# Altium schematic sheet 原理图.SchDoc
size A4
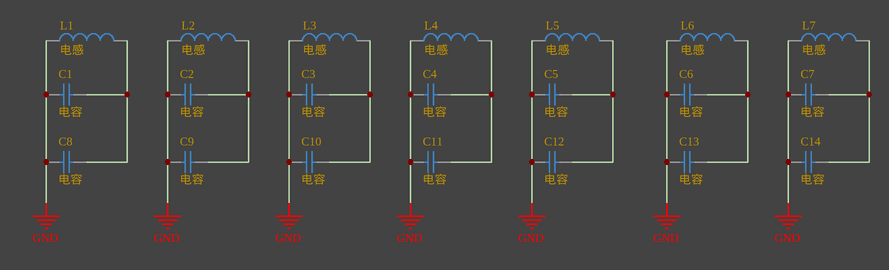
[diagram p0: 原理图.SchDoc]

## Parts
C1  电容  [C0603]
C2  电容  [C0603]
C3  电容  [C0603]
C4  电容  [C0603]
C5  电容  [C0603]
C6  电容  [C0603]
C7  电容  [C0603]
C8  电容  [C0603]
C9  电容  [C0603]
C10  电容  [C0603]
C11  电容  [C0603]
C12  电容  [C0603]
C13  电容  [C0603]
C14  电容  [C0603]
L1  电感  [LD8x10]
L2  电感  [LD8x10]
L3  电感  [LD8x10]
L4  电感  [LD8x10]
L5  电感  [LD8x10]
L6  电感  [LD8x10]
L7  电感  [LD8x10]

## Nets
GND: C1.1 C2.1 C3.1 C4.1 C5.1 C6.1 C7.1 C8.1 C9.1 C10.1 C11.1 C12.1 C13.1 C14.1 L1.1 L2.1 L3.1 L4.1 L5.1 L6.1 L7.1
NetC1_2: C1.2 C8.2 L1.2
NetC2_2: C2.2 C9.2 L2.2
NetC3_2: C3.2 C10.2 L3.2
NetC4_2: C4.2 C11.2 L4.2
NetC5_2: C5.2 C12.2 L5.2
NetC6_2: C6.2 C13.2 L6.2
NetC7_2: C7.2 C14.2 L7.2

## Notes on the sheet
- Title
- Size:
- Date:
- A4
- Number:
- Time:
- Revision:
- Sheet
- of
- File:

## Library data of the parts
C1-C14 = 电容: Capacitor; Value: 22pF; Published: 8-Jun-2000; LatestRevisionDate: 17-Jul-2002; LatestRevisionNote: Re-released for DXP Platform.; PackageReference: RAD-0.3; Publisher: Altium Limited; PackageDescription: Radial Cap, Thru-Hole; 2 Leads; 0.3 in Pin Spacing